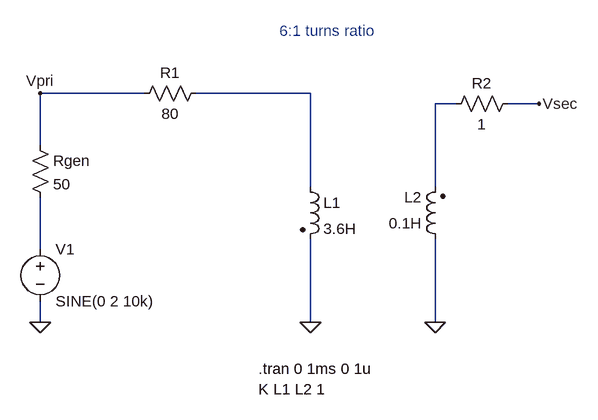
[diagram p0: schematic 6-1-transformer.asc]
6-1-transformer.asc, the LTspice schematic file:
Version 4
SHEET 1 1032 680
WIRE 240 -112 80 -112
WIRE 496 -112 320 -112
WIRE 720 -96 688 -96
WIRE 848 -96 800 -96
WIRE 80 -32 80 -112
WIRE 496 32 496 -112
WIRE 688 32 688 -96
WIRE 80 128 80 48
WIRE 80 240 80 208
WIRE 496 240 496 112
WIRE 688 240 688 112
FLAG 80 240 0
FLAG 496 240 0
FLAG 688 240 0
FLAG 80 -112 Vpri
FLAG 848 -96 Vsec
SYMBOL voltage 80 112 R0
WINDOW 123 0 0 Left 0
WINDOW 39 0 0 Left 0
SYMATTR InstName V1
SYMATTR Value SINE(0 2 10k)
SYMBOL res 64 -48 R0
SYMATTR InstName Rgen
SYMATTR Value 50
SYMBOL ind2 480 16 R0
SYMATTR InstName L1
SYMATTR Value 3.6H
SYMATTR Type ind
SYMBOL ind2 704 128 R180
WINDOW 0 36 80 Left 2
WINDOW 3 36 40 Left 2
SYMATTR InstName L2
SYMATTR Value 0.1H
SYMATTR Type ind
SYMBOL res 336 -128 R90
WINDOW 0 0 56 VBottom 2
WINDOW 3 32 56 VTop 2
SYMATTR InstName R1
SYMATTR Value 80
SYMBOL res 816 -112 R90
WINDOW 0 0 56 VBottom 2
WINDOW 3 32 56 VTop 2
SYMATTR InstName R2
SYMATTR Value 1
TEXT 416 312 Left 2 !.tran 0 1ms 0 1u\nK L1 L2 1
TEXT 448 -208 Left 2 ;6:1 turns ratio

The netlist it stands for:
* 6-1-transformer.asc
V1 N003 0 SINE(0 2 10k)
Rgen Vpri N003 50
L1 N001 0 3.6H
L2 0 N002 0.1H
R1 N001 Vpri 80
R2 Vsec N002 1
.tran 0 1ms 0 1u
K L1 L2 1
* 6:1 turns ratio
.backanno
.end